# Altium schematic sheet lv_io_nav_io.SchDoc: nav_io.schdoc
size A4; Organization: Badgerloop; Address1: 133 Engineering Research; Address2: Building; Address3: Madison, WI 53715; DocumentNumber: 1; Revision: A; SheetNumber: 1; SheetTotal: 2
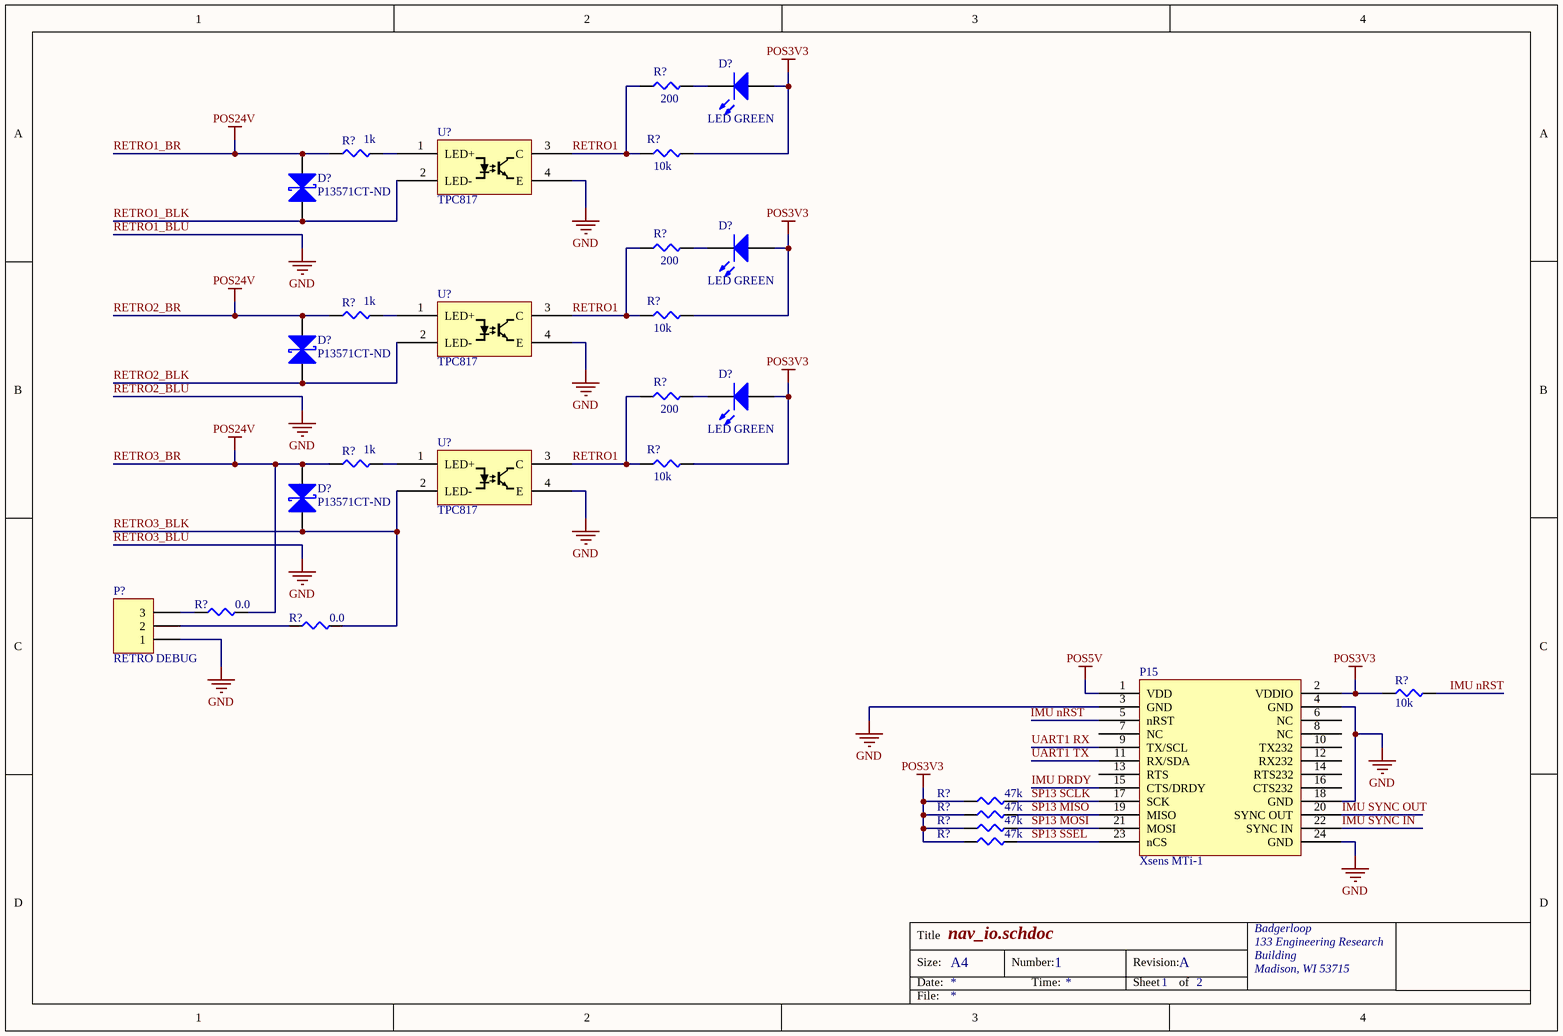
[diagram p0: lv_io_nav_io.SchDoc]

## Parts
(Parts that share a designator on the sheet are numbered #1, #2 ... from top to bottom, then left to right.)
D?#1  LED GREEN  [LED 0603 GREEN]
D?#2  Digikey P/N: P13571CT-ND  [SMD-0402-RES]  (hidden comment: ESD Diode)
D?#3  LED GREEN  [LED 0603 GREEN]
D?#4  Digikey P/N: P13571CT-ND  [SMD-0402-RES]  (hidden comment: ESD Diode)
D?#5  LED GREEN  [LED 0603 GREEN]
D?#6  Digikey P/N: P13571CT-ND  [SMD-0402-RES]  (hidden comment: ESD Diode)
P15  XSNS MTI-1  (value not drawn)
P?  RETRO DEBUG  [Pin Header 1x3 TH Pitch 2.54mm]
R?#1  200  [SMD-0603-RES]
R?#2  1k  [SMD-0603-RES]
R?#3  10k  [SMD-0603-RES]
R?#4  200  [SMD-0603-RES]
R?#5  1k  [SMD-0603-RES]
R?#6  10k  [SMD-0603-RES]
R?#7  200  [SMD-0603-RES]
R?#8  1k  [SMD-0603-RES]
R?#9  10k  [SMD-0603-RES]
R?#10  0.0  [SMD-0402-RES]
R?#11  0.0  [SMD-0402-RES]
R?#12  10k  [SMD-0402-RES]
R?#13  47k  [SMD-0402-RES]
R?#14  47k  [SMD-0402-RES]
R?#15  47k  [SMD-0402-RES]
R?#16  47k  [SMD-0402-RES]
U?#1  TPC817
U?#2  TPC817
U?#3  TPC817

## Nets
POS3V3: D?#1.1(A) D?#3.1(A) D?#5.1(A) P15.2(VDDIO) R?#3.2 R?#6.2 R?#9.2 R?#12.1 R?#13.1 R?#14.1 R?#15.1 R?#16.1
POS5V: P15.1(VDD)
RETRO1_BLU: P15.3(GND) P15.4(GND) P15.18(GND) P15.24(GND) P?.1 U?#1.4(E) U?#2.4(E) U?#3.4(E)  [also labelled GND, RETRO2_BLU, RETRO3_BLU]
RETRO1_BR: D?#2.2(K) D?#4.2(K) D?#6.2(K) R?#2.1 R?#5.1 R?#8.1 R?#10.2  [also labelled POS24V, RETRO2_BR, RETRO3_BR]
IMU DRDY: P15.15(CTS/DRDY)
IMU nRST: R?#12.2
IMU SYNC IN: P15.22(SYNC_IN)
IMU SYNC OUT: P15.20(SYNC_OUT)
RETRO1: R?#1.1 R?#3.1 R?#4.1 R?#6.1 R?#7.1 R?#9.1 U?#1.3(C) U?#2.3(C) U?#3.3(C)
RETRO1_BLK: D?#2.1(A) U?#1.2(LED-)
RETRO2_BLK: D?#4.1(A) U?#2.2(LED-)
RETRO3_BLK: D?#6.1(A) R?#11.2 U?#3.2(LED-)
SP13 MISO: P15.19(MISO) R?#14.2
SP13 MOSI: P15.21(MOSI) R?#15.2
SP13 SCLK: P15.17(SCK) R?#13.2
SP13 SSEL: P15.23(nCS) R?#16.2
UART1 RX: P15.9(TX/SCL)
UART1 TX: P15.11(RX/SDA)
NetD?#1_2: D?#1.2(K) R?#1.2
NetD?#3_2: D?#3.2(K) R?#4.2
NetD?#5_2: D?#5.2(K) R?#7.2
NetP?_2: P?.2 R?#11.1
NetP?_3: P?.3 R?#10.1
NetR?#2_2: R?#2.2 U?#1.1(LED+)
NetR?#5_2: R?#5.2 U?#2.1(LED+)
NetR?#8_2: R?#8.2 U?#3.1(LED+)

Not connected (* = marked no-connect by the designer): P15 5(nRST) 6(NC) 7(NC) 8(NC) 10(TX232) 12(RX232) 13(RTS) 14(RTS232) 16(CTS232)

## Notes on the sheet
- Labels drawn without touching a wire or pin: IMU nRST
- Title
- Size:
- Date:
- A4
- Number:
- Time:
- Revision:
- Sheet
- of
- File:
- (in symbol XSNS MTI-1) Xsens MTi-1

## Library data of the parts
D?#1 D?#3 D?#5 = LED GREEN 0603: Manufacturer: Lite-On Inc.; Manufacturer P/N: LTST-C190KGKT; Digikey P/N: 160-1435-1-ND; Package / Case: 0603; Color: GREEN
D?#2 D?#4 D?#6 = ESD Diode: ESD Supressor; Manufacturer P/N: Panasonic; Manufacturer: EZAEG; Digikey Link: https://www.digikey.com/product-detail/en/panasonic-electronic-components/EZA-EG2A50AX/P13571CT-ND/1137239
P? = Header 3: Header, 3-Pin; LatestRevisionDate: 17-Jul-2002; LatestRevisionNote: Re-released for DXP Platform.; Publisher: Altium Limited
R?#1 R?#4 R?#7 = ERJ-P03J201V: RES SMD 200 OHM 5% 1/5W 0603; Manufacturer: Panasonic Electronic Components; Factory Stock: 0; Unit Price (USD): 0.03584; @ qty: 1500; Minimum Quantity: 1; Power (Watts): 0.2W, 1/5W; Temperature Coefficient: ±200ppm/°C; Value: 200; Part Number: ERJ-P03J201V; Datasheets: https://industrial.panasonic.com/cdbs/www-data/pdf/RDA0000/AOA0000C243.pdf; Image: //media.digikey.com/Photos/Panasonic%20Photos/MFG_ERJ-P6W%20Series.jpg; Digi-Key Part Number: P16033CT-ND; Quantity Available: 6803; Packaging: Cut Tape (CT); Series: ERJ; Part Status: Active; Tolerance: ±5%; Composition: Thick Film; Features: Automotive AEC-Q200, Pulse Withstanding; Operating Temperature: -55°C ~ 155°C; Package / Case: 0603 (1608 Metric); Supplier Device Package: 0603; Size / Dimension: 0.063" L x 0.031" W (1.60mm x 0.80mm); Height - Seated (Max): 0.022" (0.55mm); Number of Terminations: 2; Failure Rate: -
R?#2 R?#5 R?#8 = ERJ-P03F1001V: RES SMD 1K OHM 1% 1/5W 0603; Manufacturer: Panasonic Electronic Components; Factory Stock: 0; Unit Price (USD): 0.05227; @ qty: 1500; Minimum Quantity: 1; Power (Watts): 0.2W, 1/5W; Temperature Coefficient: ±200ppm/°C; Value: 1k; Part Number: ERJ-P03F1001V; Datasheets: https://industrial.panasonic.com/cdbs/www-data/pdf/RDA0000/AOA0000C243.pdf; Image: //media.digikey.com/Photos/Panasonic%20Photos/MFG_ERJ-P6W%20Series.jpg; Digi-Key Part Number: P16018CT-ND; Quantity Available: 3331; Packaging: Cut Tape (CT); Series: ERJ; Part Status: Active; Tolerance: ±1%; Composition: Thick Film; Features: Automotive AEC-Q200, Pulse Withstanding; Operating Temperature: -55°C ~ 155°C; Package / Case: 0603 (1608 Metric); Supplier Device Package: 0603; Size / Dimension: 0.063" L x 0.031" W (1.60mm x 0.80mm); Height - Seated (Max): 0.022" (0.55mm); Number of Terminations: 2; Failure Rate: -
R?#3 R?#6 R?#9 = ERJ-P03J103V: RES SMD 10K OHM 5% 1/5W 0603; Manufacturer: Panasonic Electronic Components; Factory Stock: 0; Unit Price (USD): 0.03584; @ qty: 1500; Minimum Quantity: 1; Power (Watts): 0.2W, 1/5W; Temperature Coefficient: ±200ppm/°C; Value: 10k; Part Number: ERJ-P03J103V; Datasheets: https://industrial.panasonic.com/cdbs/www-data/pdf/RDA0000/AOA0000C243.pdf; Image: //media.digikey.com/Photos/Panasonic%20Photos/MFG_ERJ-P6W%20Series.jpg; Digi-Key Part Number: P16032CT-ND; Quantity Available: 857; Packaging: Cut Tape (CT); Series: ERJ; Part Status: Active; Tolerance: ±5%; Composition: Thick Film; Features: Automotive AEC-Q200, Pulse Withstanding; Operating Temperature: -55°C ~ 155°C; Package / Case: 0603 (1608 Metric); Supplier Device Package: 0603; Size / Dimension: 0.063" L x 0.031" W (1.60mm x 0.80mm); Height - Seated (Max): 0.022" (0.55mm); Number of Terminations: 2; Failure Rate: -
R?#10 R?#11 = ERJ-2GE0R00X: RES SMD 0.0OHM JUMPER 1/10W 0402; Manufacturer: Panasonic Electronic Components; Factory Stock: 0; Unit Price (USD): 0.00384; @ qty: 1500; Minimum Quantity: 1; Power (Watts): 0.1W, 1/10W; Part Number: ERJ-2GE0R00X; Datasheets: http://industrial.panasonic.com/www-cgi/jvcr13pz.cgi?E+PZ+3+AOA0001+ERJ2GE0R00X+7+WW; Image: //media.digikey.com/Photos/Panasonic%20Photos/ERJ-PA2-Series.jpg; Digi-Key Part Number: P0.0JCT-ND; Quantity Available: 3152483; Packaging: Cut Tape (CT); Series: ERJ; Part Status: Active; Value: 0.0; Tolerance: Jumper; Composition: Thick Film; Features: Automotive AEC-Q200; Temperature Coefficient: -; Operating Temperature: -55°C ~ 155°C; Package / Case: 0402 (1005 Metric); Supplier Device Package: 0402; Size / Dimension: 0.039" L x 0.020" W (1.00mm x 0.50mm); Height - Seated (Max): 0.016" (0.40mm); Number of Terminations: 2; Failure Rate: -
R?#12 = ERJ-2RKF1002X: RES SMD 10K OHM 1% 1/10W 0402; Manufacturer: Panasonic Electronic Components; Factory Stock: 0; Unit Price (USD): 0.00496; @ qty: 1500; Minimum Quantity: 1; Power (Watts): 0.1W, 1/10W; Temperature Coefficient: ±100ppm/°C; Part Number: ERJ-2RKF1002X; Datasheets: http://industrial.panasonic.com/www-cgi/jvcr13pz.cgi?E+PZ+3+AOA0002+ERJ2RKF1002X+7+WW; Image: //media.digikey.com/Photos/Panasonic%20Photos/ERJ-PA2-Series.jpg; Digi-Key Part Number: P10.0KLCT-ND; Quantity Available: 9922786; Packaging: Cut Tape (CT); Series: ERJ; Part Status: Active; Value: 10k; Tolerance: ±1%; Composition: Thick Film; Features: Automotive AEC-Q200; Operating Temperature: -55°C ~ 155°C; Package / Case: 0402 (1005 Metric); Supplier Device Package: 0402; Size / Dimension: 0.039" L x 0.020" W (1.00mm x 0.50mm); Height - Seated (Max): 0.016" (0.40mm); Number of Terminations: 2; Failure Rate: -
R?#13-R?#16 = ERJ-2GEJ473X: RES SMD 47K OHM 5% 1/10W 0402; Manufacturer: Panasonic Electronic Components; Factory Stock: 0; Unit Price (USD): 0.00350; @ qty: 1500; Minimum Quantity: 1; Power (Watts): 0.1W, 1/10W; Temperature Coefficient: ±200ppm/°C; Part Number: ERJ-2GEJ473X; Datasheets: http://industrial.panasonic.com/www-cgi/jvcr13pz.cgi?E+PZ+3+AOA0001+ERJ2GEJ473X+7+WW; Image: //media.digikey.com/Photos/Panasonic%20Photos/ERJ-PA2-Series.jpg; Digi-Key Part Number: P47KJCT-ND; Quantity Available: 5182645; Packaging: Cut Tape (CT); Series: ERJ; Part Status: Active; Value: 47k; Tolerance: ±5%; Composition: Thick Film; Features: Automotive AEC-Q200; Operating Temperature: -55°C ~ 155°C; Package / Case: 0402 (1005 Metric); Supplier Device Package: 0402; Size / Dimension: 0.039" L x 0.020" W (1.00mm x 0.50mm); Height - Seated (Max): 0.016" (0.40mm); Number of Terminations: 2; Failure Rate: -